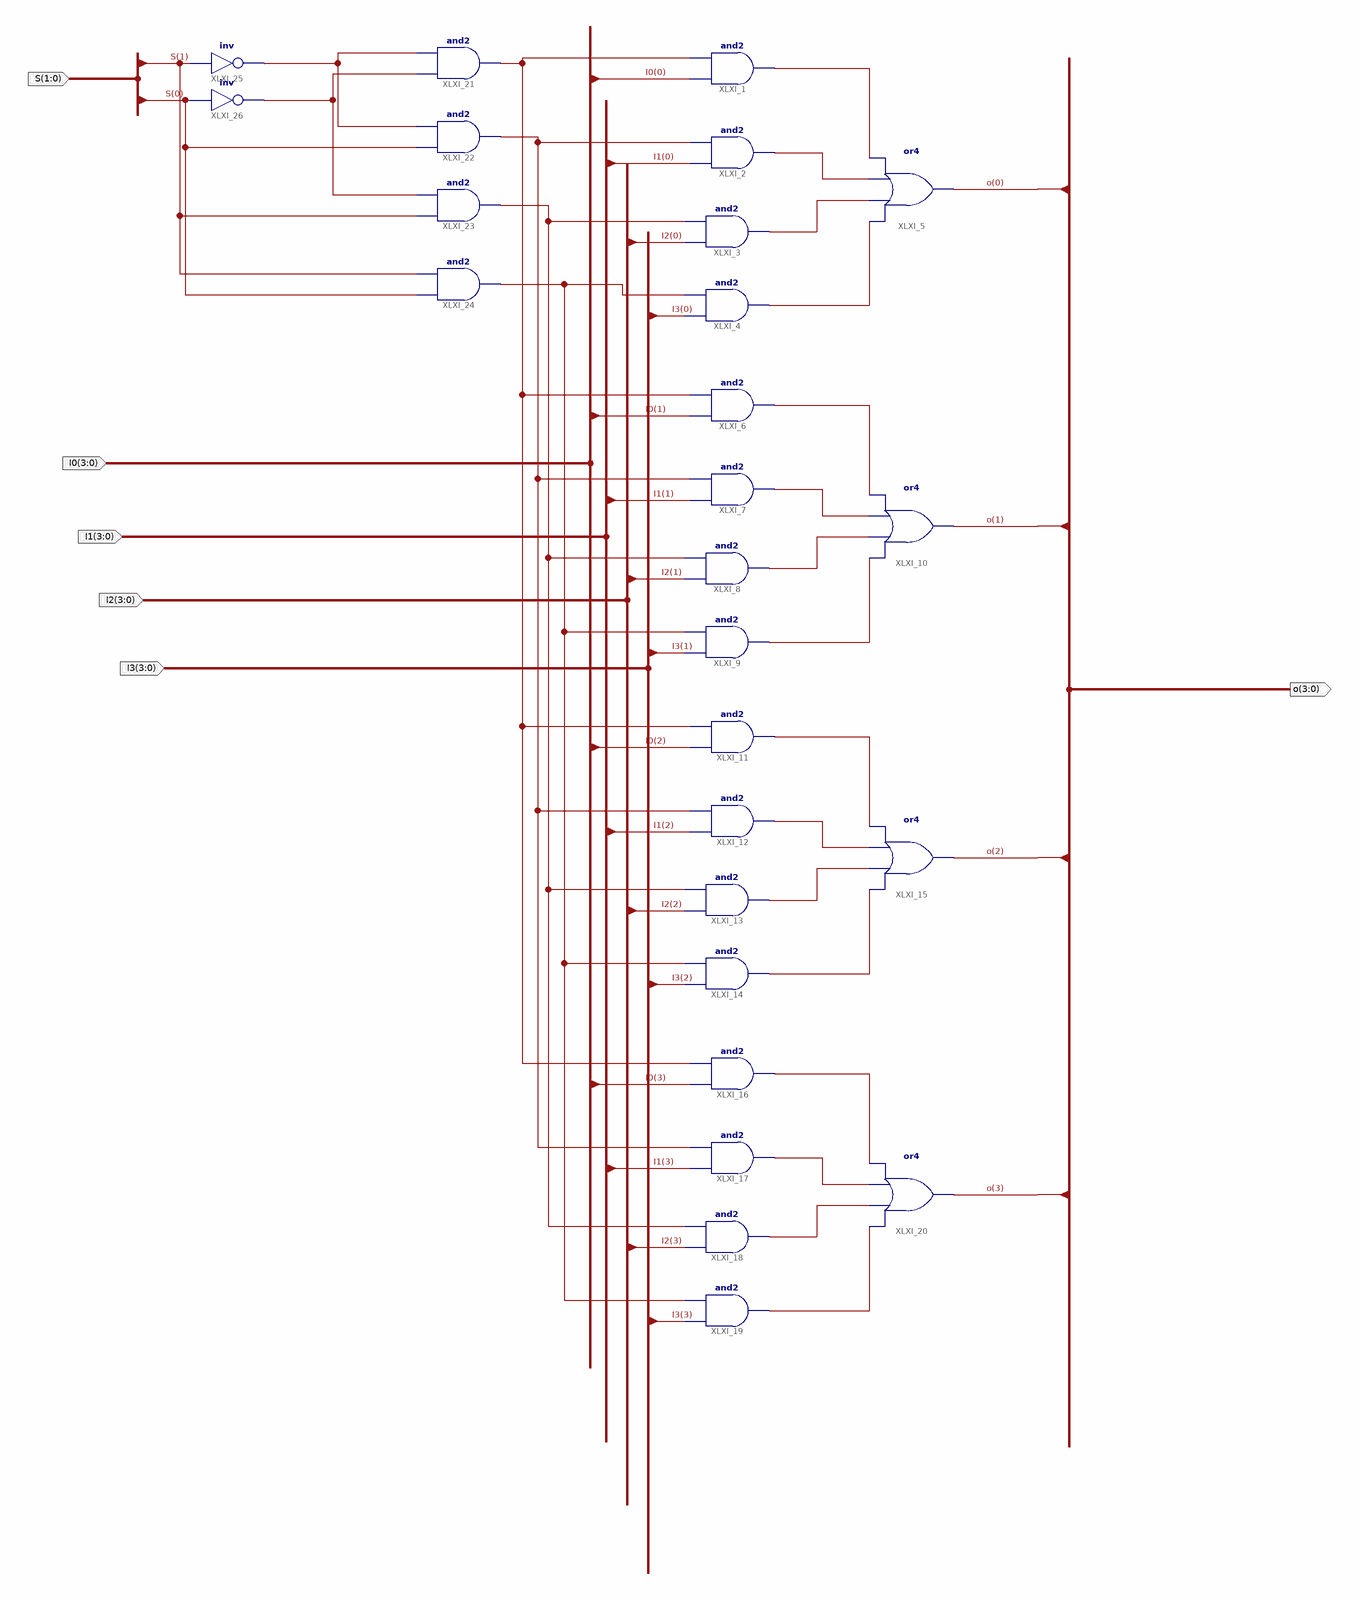
[diagram p0: schematic sheet 1]
// Xilinx ISE schematic Mux4to1b4.sch (kintex7) as structural Verilog: 26 symbols, 6 ports
module Mux4to1b4 (
  input  [1:0] S,
  input  [3:0] I0,
  input  [3:0] I1,
  input  [3:0] I2,
  input  [3:0] I3,
  output [3:0] o
);

  wire XLXN_1, XLXN_2, XLXN_3, XLXN_4, XLXN_5, XLXN_6, XLXN_7, XLXN_8, XLXN_9, XLXN_10, XLXN_11, XLXN_12,
       XLXN_13, XLXN_14, XLXN_15, XLXN_16, XLXN_22, XLXN_24, XLXN_30, XLXN_31, XLXN_33, XLXN_37;

  and XLXI_1 (XLXN_1, I0[0], XLXN_30);
  and XLXI_2 (XLXN_2, I1[0], XLXN_31);
  and XLXI_3 (XLXN_3, I2[0], XLXN_33);
  and XLXI_4 (XLXN_4, I3[0], XLXN_37);
  or XLXI_5 (o[0], XLXN_4, XLXN_3, XLXN_2, XLXN_1);
  and XLXI_6 (XLXN_5, I0[1], XLXN_30);
  and XLXI_7 (XLXN_6, I1[1], XLXN_31);
  and XLXI_8 (XLXN_7, I2[1], XLXN_33);
  and XLXI_9 (XLXN_8, I3[1], XLXN_37);
  or XLXI_10 (o[1], XLXN_8, XLXN_7, XLXN_6, XLXN_5);
  and XLXI_11 (XLXN_9, I0[2], XLXN_30);
  and XLXI_12 (XLXN_10, I1[2], XLXN_31);
  and XLXI_13 (XLXN_11, I2[2], XLXN_33);
  and XLXI_14 (XLXN_12, I3[2], XLXN_37);
  or XLXI_15 (o[2], XLXN_12, XLXN_11, XLXN_10, XLXN_9);
  and XLXI_16 (XLXN_13, I0[3], XLXN_30);
  and XLXI_17 (XLXN_14, I1[3], XLXN_31);
  and XLXI_18 (XLXN_15, I2[3], XLXN_33);
  and XLXI_19 (XLXN_16, I3[3], XLXN_37);
  or XLXI_20 (o[3], XLXN_16, XLXN_15, XLXN_14, XLXN_13);
  and XLXI_21 (XLXN_30, XLXN_24, XLXN_22);
  and XLXI_22 (XLXN_31, S[0], XLXN_22);
  and XLXI_23 (XLXN_33, S[1], XLXN_24);
  and XLXI_24 (XLXN_37, S[0], S[1]);
  not XLXI_25 (XLXN_22, S[1]);
  not XLXI_26 (XLXN_24, S[0]);
endmodule
